# EAGLE design CondizionamentoLM311 (EAGLE 7.2.0)
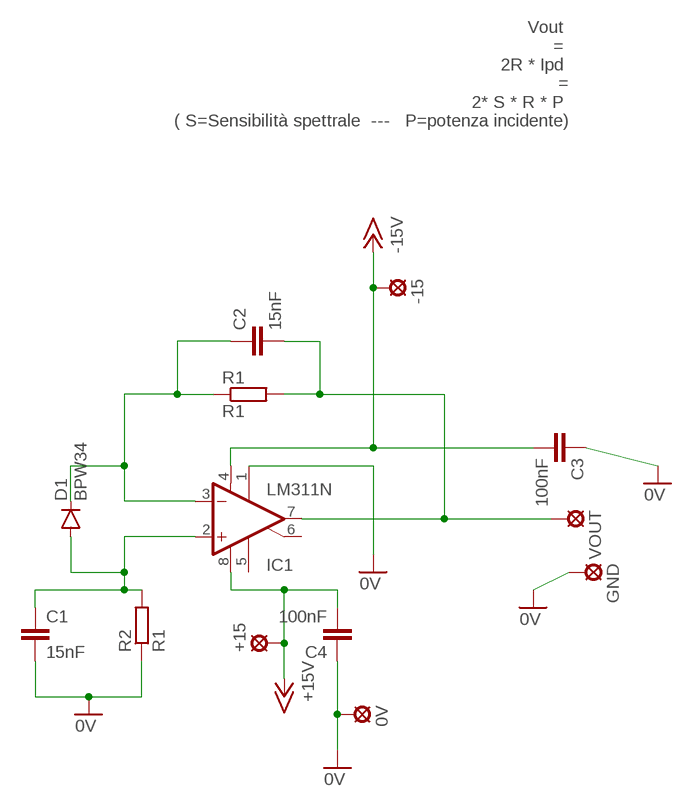
[diagram p0: schematic, sheet 1]

## Parts
0V  0V  LSP10  [LSP10]
+15  +15  LSP10  [LSP10]
-15  -15  LSP10  [LSP10]
C1  15nF  C-EU050-024X044  [C050-024X044]
C2  15nF  C-EU050-024X044  [C050-024X044]
C3  100nF  C-EU050-024X044  [C050-024X044]
C4  100nF  C-EU050-024X044  [C050-024X044]
D1  BPW34  [BPW34]
GND  0V  LSP10  [LSP10]
IC1  LM311N  [DIL08]
R1  R1  R-EU_0207/10  [0207/10]
R2  R1  R-EU_0207/10  [0207/10]
VOUT  Vout  LSP10  [LSP10]

## Nets
0V: 0V.MP C1.2 C3.1 C4.1 GND.MP IC1.1(GND) R2.1
+15V: +15.MP C4.2 IC1.8(V+)
-15V: -15.MP C3.2 IC1.4(V-)
N$1: C2.2 IC1.7(OUT) R1.2 VOUT.MP
N$2: C1.1 D1.P$1(A) IC1.2(+IN) R2.2
N$4: C2.1 D1.P$2(C) IC1.3(-IN) R1.1
Unconnected: IC1.5(ON) IC1.6(ON/STR)

## Notes on the sheet
- Vout 
        = 
  2R * Ipd 
        =
  2* S * R * P 
  ( S=Sensibilità spettrale  ---   P=potenza incidente)

## Library data of the parts
0V +15 -15 GND VOUT = solpad:LSP10: SOLDER PAD drill 1.0 mm, distributor Buerklin, 12H555
C1-C4 = resistor:C-EU: CAPACITOR, European symbol
D1 = SparkFun-Sensors:BPW34: Large-area PIN photodiode ("miniature solar cell") Datasheet: https://www.sparkfun.com/datasheets/Prototyping/Solar/bpw34.pdf; STOREID: 9541
IC1 = linear:LM311: COMPARATOR
R1 R2 = resistor:R-EU_: RESISTOR, European symbol

## Board
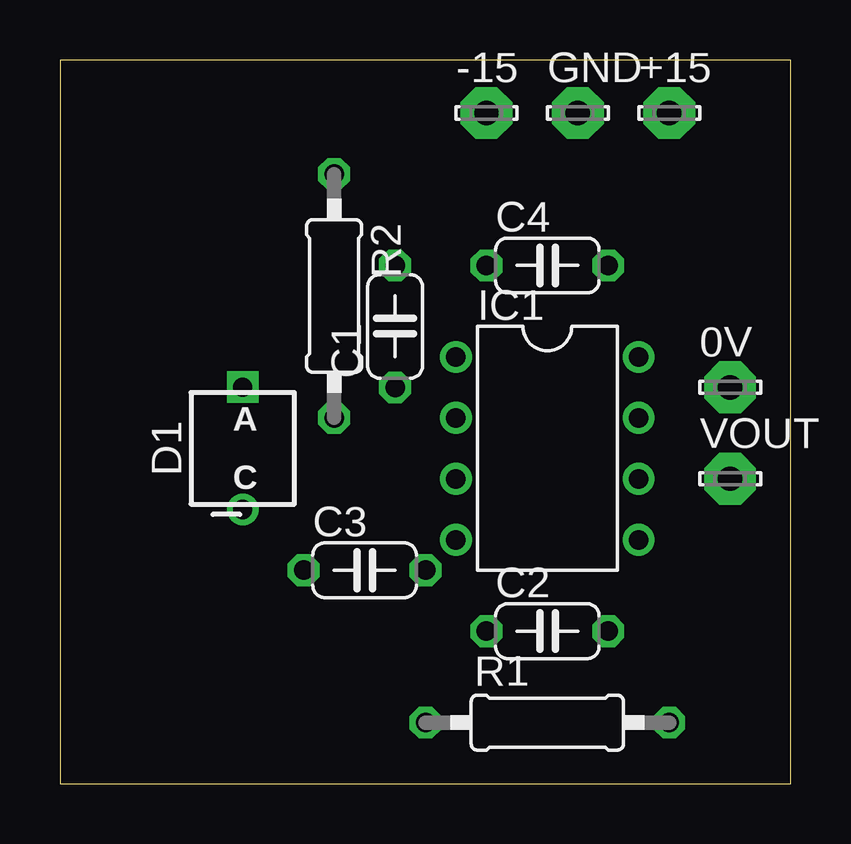
[diagram p1: board, top side]
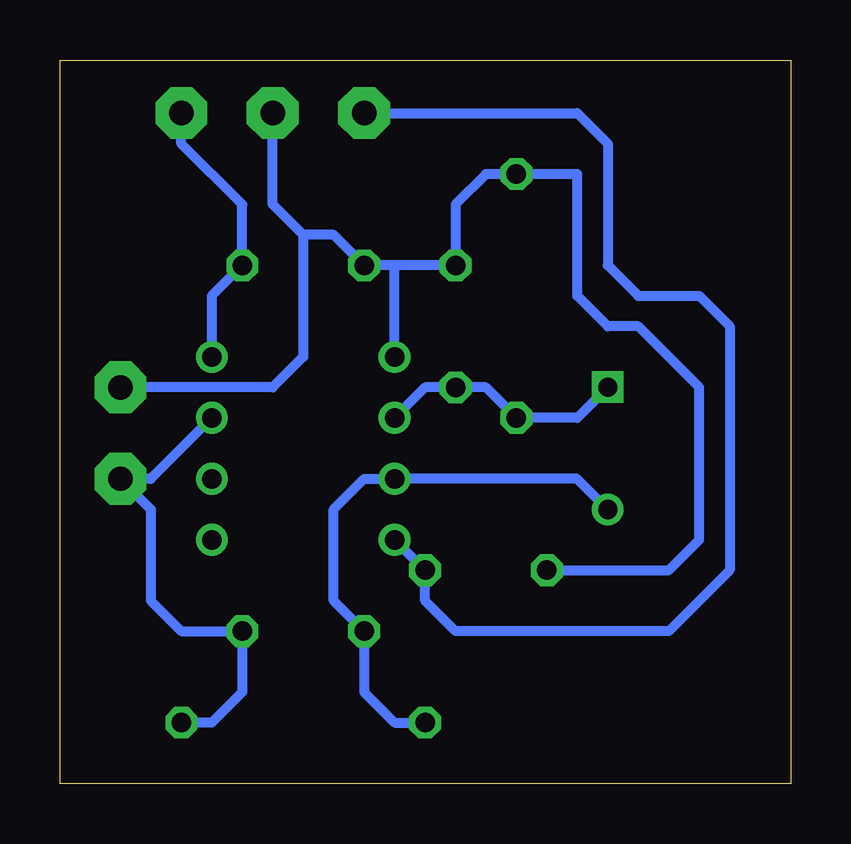
[diagram p2: board, bottom side, seen from below]

Size 30.46 x 30.15 mm. Coordinates in mm from the lower left corner, seen from the top.
Outline: 0,0 30.46,0 30.46,30.15 0,30.15 0,0
Copper layers (1*16): Top 0.035mm / dielectric 1.5mm / Bottom 0.035mm
Design rules "default": minimum track width 10mil, minimum drill 24mil, track to track 8mil, track to pad 8mil, pad to pad 8mil, via to via 8mil, smd to smd 8mil, copper to edge 40mil, drill to drill 8mil, minimum pad ring 10mil, minimum via ring 8mil, stop-mask expansion 4mil, vias tented up to drill 0mil, thermal gap 10mil

### Footprints (pad centres in the part's own frame; a part is rotated, then mirrored left to right if it is on the bottom)
LSP10 = drill 1.016 pad 2.159 octagon: MP 0,0
C050-024X044 = drill 0.813 octagon: 1 -2.54,0; 2 2.54,0
BPW34 = drill 0.8 square: P$1 0,2.55 | drill 0.8: P$2 0,-2.55
DIL08 = drill 0.813 pad 1.27: 1 -3.81,-3.81; 2 -1.27,-3.81; 3 1.27,-3.81; 4 3.81,-3.81; 5 3.81,3.81; 6 1.27,3.81; 7 -1.27,3.81; 8 -3.81,3.81
0207/10 = drill 0.813 octagon: 1 -5.08,0; 2 5.08,0

### Placement (x,y rotation side)
0V  27.94,16.51 0 top
+15  25.4,27.94 0 top
-15  17.78,27.94 0 top
C1  13.97,19.05 90 top
C2  20.32,6.35 0 top
C3  12.7,8.89 0 top
C4  20.32,21.59 0 top
D1  7.62,13.97 0 top
GND  21.59,27.94 0 top
IC1  20.32,13.97 270 top
R1  20.32,2.54 0 top
R2  11.43,20.32 270 top
VOUT  27.94,12.7 0 top

### Tracks (layer width: path | path; a pad name or v marks a point on that pad's centre or on a via)
0V
  Bottom 0.406: 16.51,21.59 C1.2 13.97,24.13 12.7,25.4 R2.1 8.89,25.4 8.89,20.32 7.62,19.05 6.35,19.05 3.81,16.51 3.81,10.16 5.08,8.89 C3.1 | 16.51,21.59 C4.1 19.05,22.86 20.32,22.86 | GND.MP 21.59,24.13 20.32,22.86 | IC1.1 16.51,21.59 | 20.32,22.86 20.32,17.78 21.59,16.51 0V.MP
+15V
  Bottom 0.406: +15.MP 25.4,26.67 22.86,24.13 C4.2 24.13,20.32 IC1.8
-15V
  Bottom 0.406: IC1.4 C3.2 15.24,7.62 13.97,6.35 5.08,6.35 2.54,8.89 2.54,19.05 3.81,20.32 6.35,20.32 7.62,21.59 7.62,26.67 8.89,27.94 -15.MP
N$1
  Bottom 0.406: IC1.7 26.67,12.7 VOUT.MP 26.67,11.43 26.67,7.62 25.4,6.35 C2.2 22.86,3.81 24.13,2.54 R1.2
N$2
  Bottom 0.406: IC1.2 15.24,16.51 C1.1 12.7,16.51 R2.2 8.89,15.24 8.89,15.25 D1.P$1
N$4
  Bottom 0.406: R1.1 16.51,2.54 17.78,3.81 C2.1 19.05,7.62 19.05,11.43 17.78,12.7 IC1.3 8.89,12.7 8.89,12.69 D1.P$2